# Altium project NRF24L01.PrjPcb
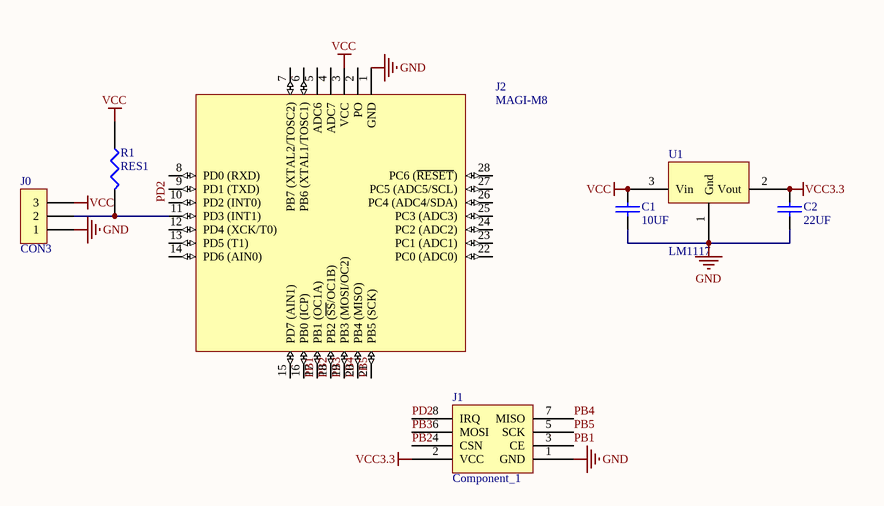
[diagram p0: NRF24L01.SchDoc]
1 sheet, 7 parts. Net scope: global (net labels, ports and power ports of the same name join across sheets).
Board file: NRF24L01.PcbDoc

## Sheet NRF24L01.SchDoc
size A4

### Parts
C1  10UF  [0805]
C2  22UF  [0805]
J0  CON3  [CON3]
J1  Component_1  [NRF24L01]
J2  MAGI-M8  [MAGI-M8]
R1  RES1  [0805]
U1  LM1117  [SOT-223]

### Nets
GND: C1.2 C2.2 J0.1 J1.1(GND) J2.1(GND) U1.1(Gnd)
VCC: C1.1 J0.3 J2.3(VCC) R1.1 U1.3(Vin)
VCC3.3: C2.1 J1.2(VCC) U1.2(Vout)
PB1: J1.3(CE) J2.17(PB1_(OC1A))
PB2: J1.4(CSN) J2.18(PB2_(~{SS}/OC1B))
PB3: J1.6(MOSI) J2.19(PB3_(MOSI/OC2))
PB4: J1.7(MISO) J2.20(PB4_(MISO))
PB5: J1.5(SCK) J2.21(PB5_(SCK))
PD2: J1.8(IRQ) J2.10(PD2_(INT0))
NetJ0_2: J0.2 J2.11(PD3_(INT1)) R1.2

Not connected (* = marked no-connect by the designer): J2 2(PO) 4(ADC7) 5(ADC6) 6(PB6_(XTAL1/TOSC1)) 7(PB7_(XTAL2/TOSC2)) 8(PD0_(RXD)) 9(PD1_(TXD)) 12(PD4_(XCK/T0)) 13(PD5_(T1)) 14(PD6_(AIN0)) 15(PD7_(AIN1)) 16(PB0_(ICP)) 22(PC0_(ADC0)) 23(PC1_(ADC1)) 24(PC2_(ADC2)) 25(PC3_(ADC3)) 26(PC4_(ADC4/SDA)) 27(PC5_(ADC5/SCL)) 28(PC6_(~{RESET}))

### Library data of the parts
C1 C2 = CAP_1: Capacitor
J0 = CON3: Connector